# Altium schematic sheet USB.SchDoc: USB
size A3; Author: Eladio Delgado Mingorance; CompanyName: bq - Mundo Reader; Organization: bq - Mundo Reader; Revision: 1.4; SheetNumber: 5; SheetTotal: 10
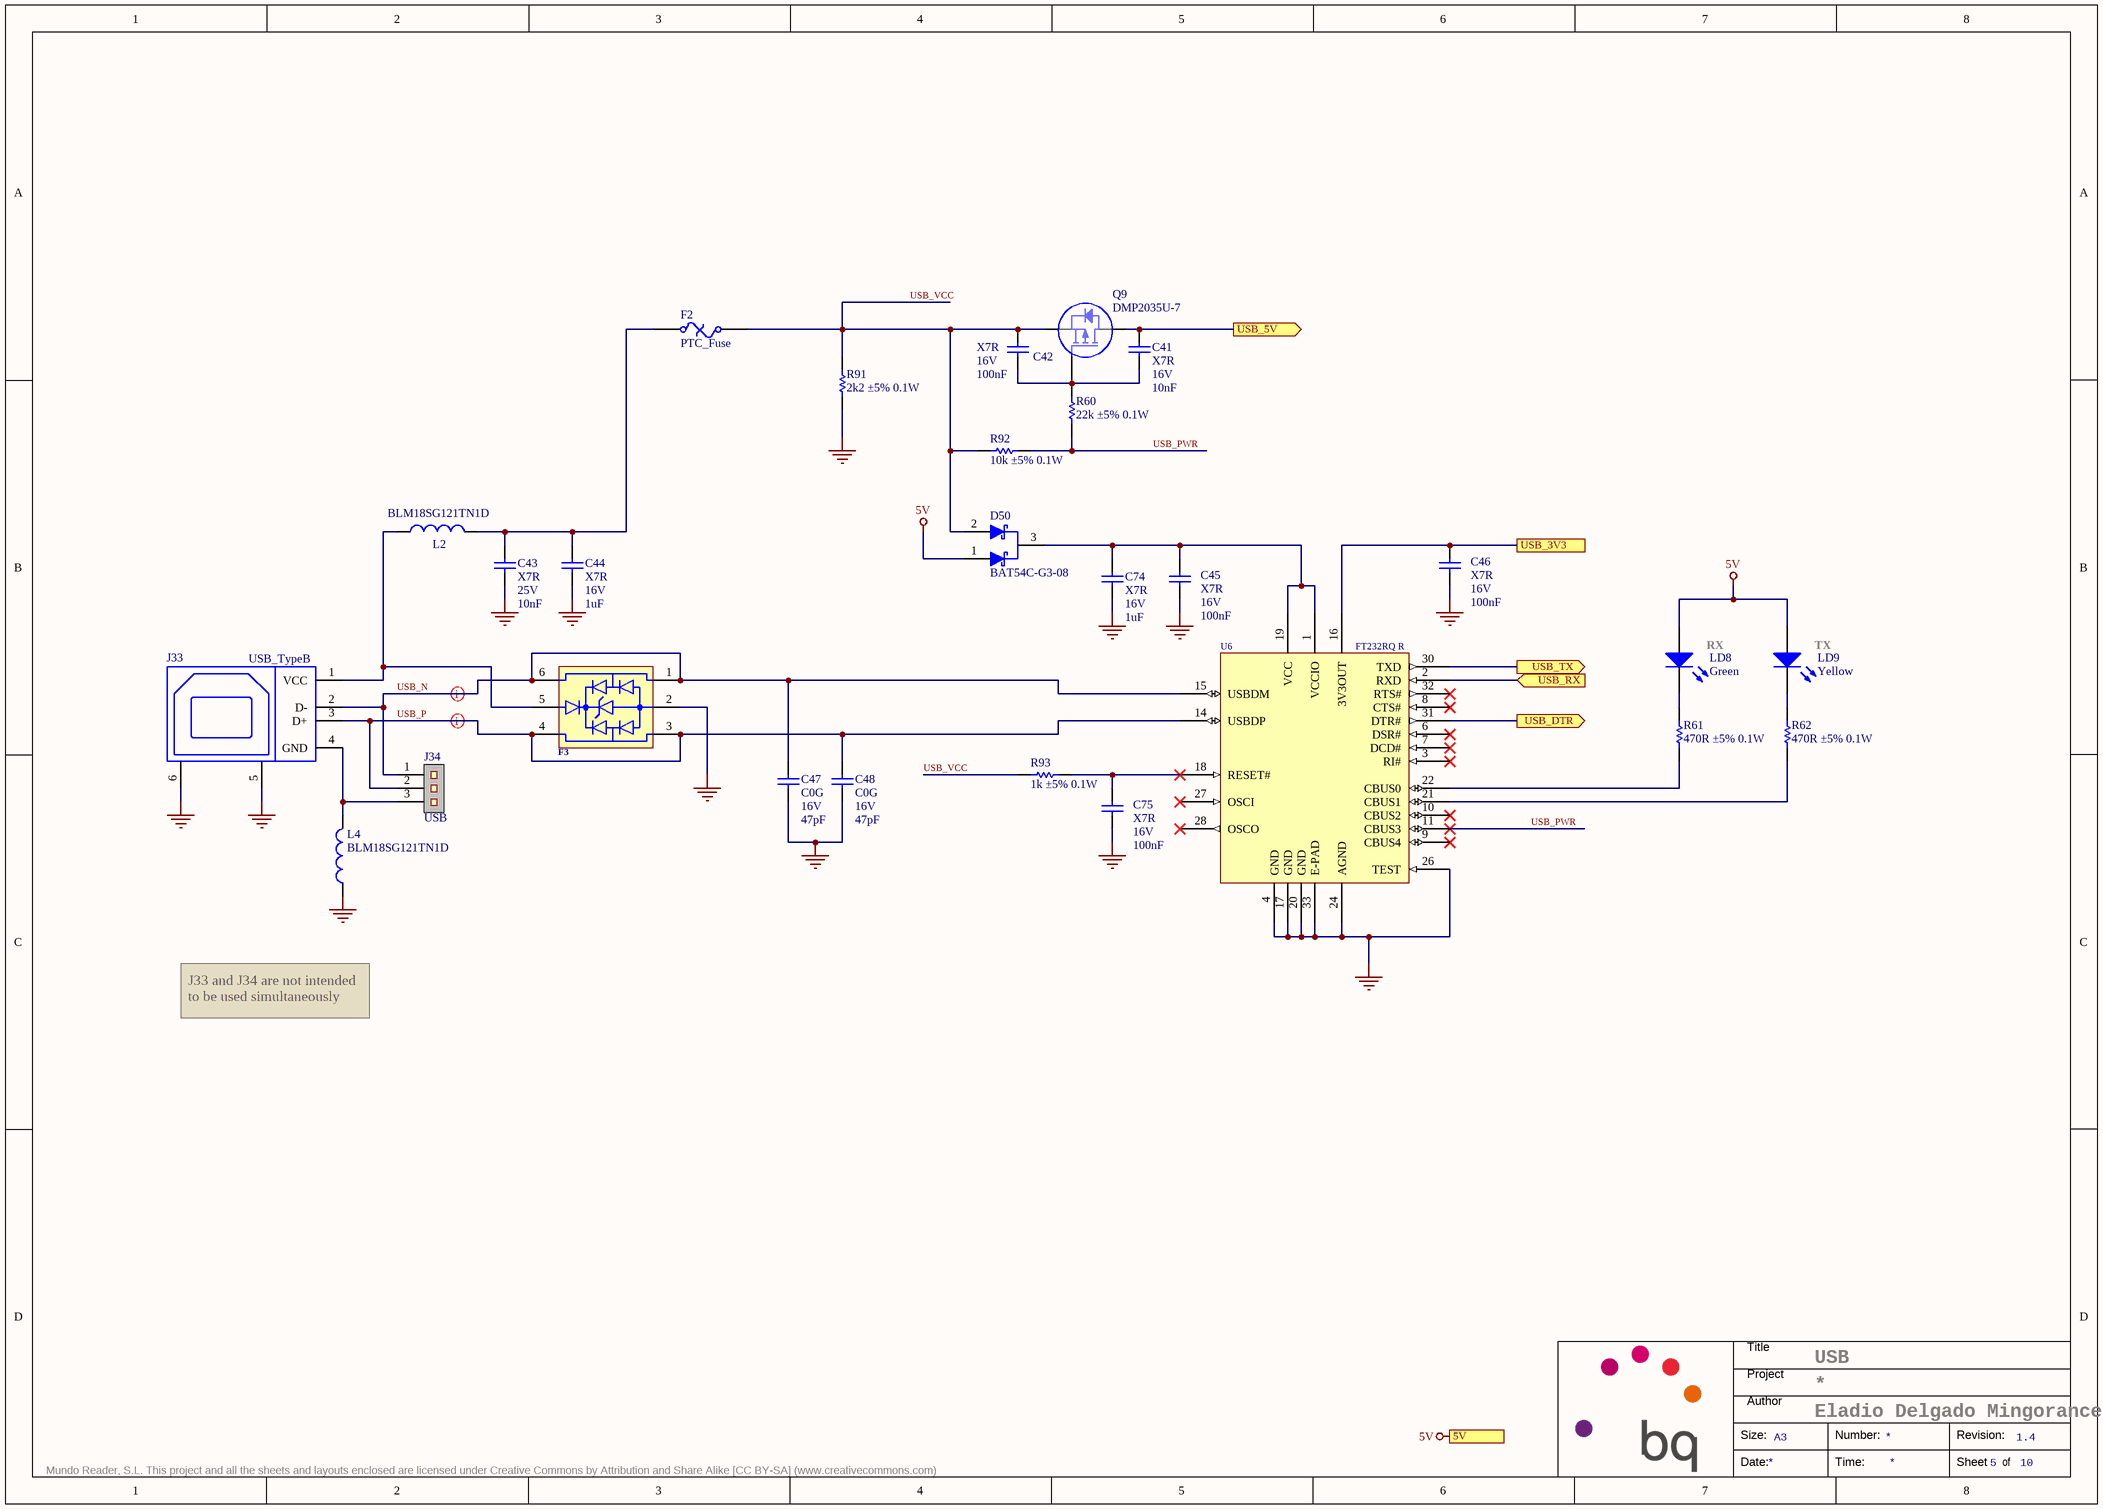
[diagram p0: USB.SchDoc]

## Parts
C41  Dielectric: X7R  Voltage: 16V  Capacitance: 10nF  [C0603]  (hidden comment: Capacitor)
C42  Dielectric: X7R  Voltage: 16V  Capacitance: 100nF  [C0603]  (hidden comment: Capacitor)
C43  Dielectric: X7R  Voltage: 25V  Capacitance: 10nF  [C0603]  (hidden comment: Capacitor)
C44  Dielectric: X7R  Voltage: 16V  Capacitance: 1uF  [C0603]  (hidden comment: Capacitor)
C45  Dielectric: X7R  Voltage: 16V  Capacitance: 100nF  [C0603]  (hidden comment: Capacitor)
C46  Dielectric: X7R  Voltage: 16V  Capacitance: 100nF  [C0603]  (hidden comment: Capacitor)
C47  Dielectric: C0G  Voltage: 16V  Capacitance: 47pF  [C0603]  (hidden comment: Capacitor)
C48  Dielectric: C0G  Voltage: 16V  Capacitance: 47pF  [C0603]  (hidden comment: Capacitor)
C74  Dielectric: X7R  Voltage: 16V  Capacitance: 1uF  [C0603]  (hidden comment: Capacitor)
C75  Dielectric: X7R  Voltage: 16V  Capacitance: 100nF  [C0603]  (hidden comment: Capacitor)
D50  BAT54C-G3-08  [SOT23-3]
F2  PTC_Fuse  [F1812]
F3  ESDUSB  [SOT563]  (value not drawn)
J33  USB_TypeB  [USB_TypeB]
J34  USB  [1x3 MTE Straight Header 2.54mm]
L2  BLM18SG121TN1D  [L0603]
L4  BLM18SG121TN1D  [L0603]
LD8  Green  [LED0603]
LD9  Yellow  [LED0603]
Q9  DMP2035U-7  [SOT23-3]
R60  value 22k ±5% 0.1W  [R0603]  (hidden comment: Resistor)
R61  value 470R ±5% 0.1W  [R0603]  (hidden comment: Resistor)
R62  value 470R ±5% 0.1W  [R0603]  (hidden comment: Resistor)
R91  value 2k2 ±5% 0.1W  [R0603]  (hidden comment: Resistor)
R92  value 10k ±5% 0.1W  [R0603]  (hidden comment: Resistor)
R93  value 1k ±5% 0.1W  [R0603]  (hidden comment: Resistor)
U6  FT232RQ R  [QFN32]

## Ports
5V, USB_3V3, USB_5V (out), USB_DTR (out), USB_RX (in), USB_TX (out)

## Nets
5V: D50.1(A1) LD8.A LD9.A ; port 5V
GND: C43.1 C44.1 C45.1 C46.1 C47.1 C48.1 C74.1 C75.1 F3.2(GND) J33.5(S) J33.6(S) L4.1 R91.2 U6.4(GND) U6.17(GND) U6.20(GND) U6.24(AGND) U6.26(TEST) U6.33(E-PAD)
USB_3V3: C46.2 U6.16(3V3OUT) ; port USB_3V3
USB_5V: C41.2 Q9.3(D) ; port USB_5V
USB_DTR: U6.31(DTR#) ; port USB_DTR
USB_N: C47.2 F3.1(I/0_1) F3.6(I/O_1) J33.2(D-) J34.1 U6.15(USBDM)
USB_P: C48.2 F3.3(I/O_2) F3.4(I/O_2) J33.3(D+) J34.2 U6.14(USBDP)
USB_PWR: R60.2 R92.1 U6.11(CBUS3)
USB_RX: U6.2(RXD) ; port USB_RX
USB_TX: U6.30(TXD) ; port USB_TX
USB_VCC: C42.2 D50.2(A2) F2.2 Q9.2(S) R91.1 R92.2 R93.1
NetC41_1: C41.1 C42.1 Q9.1(G) R60.1
NetC43_2: C43.2 C44.2 F2.1 L2.2
NetC45_2: C45.2 C74.2 D50.3(K) U6.1(VCCIO) U6.19(VCC)
NetC75_2: C75.2 R93.2 U6.18(RESET#)
NetF3_5: F3.5(VDD) J33.1(VCC) L2.1
NetJ33_4: J33.4(GND) J34.3 L4.2
NetLD8_K: LD8.K R61.2
NetLD9_K: LD9.K R62.2
NetR61_1: R61.1 U6.22(CBUS0)
NetR62_1: R62.1 U6.21(CBUS1)

Not connected (* = marked no-connect by the designer): U6 3(RI#)* 5(N.C.) 6(DSR#)* 7(DCD#)* 8(CTS#)* 9(CBUS4)* 10(CBUS2)* 12(N.C.) 13(N.C.) 23(N.C.) 25(N.C.) 27(OSCI)* 28(OSCO)* 29(N.C.) 32(RTS#)*

## Layout directives
differential pair: USB_N, USB_P

## Notes on the sheet
- (near LD8) RX
- (near LD9) TX
- J33 and J34 are not intended to be used simultaneously
- Title
- Project
- Size:
- Author
- A3
- Number:
- Revision:
- Mundo Reader, S.L. This project and all the sheets and layouts enclosed are licensed under Creative Commons by Attribution and Share Alike [CC BY-SA] (www.creativecommons.com)
- Date:
- Time:
- Sheet
- of

## Library data of the parts
C41 = C0603_10nF_16V_±10%: Capacitor SMD; Manufacturer: Kemet; Value: 10nF ±10% 16V; Tolerance: ±10%; OrderingCode: C0603C103K4RAC; Temp_ Max: 125; Temp_ Min: -55; Part Number: C0603_10nF_16V_±10%; Price (€): 0,035
C42 C45 C46 C75 = C0603_100nF_16V_±10%: Manufacturer: Kemet; Value: 100nF ±10% 16V; Tolerance: ±10%; OrderingCode: C0603C104K4RAC; Temp_ Max: 125; Temp_ Min: -55; Part Number: C0603_100nF_16V_±10%; Price (€): 0,012
C43 = C0603_10nF_25V_±10%: Manufacturer: Kemet; Value: 10nF ±10% 25V; Tolerance: ±10%; OrderingCode: C0603C103K3RAC; Temp_ Max: 125; Temp_ Min: -55; Part Number: C0603_10nF_25V_±10%; Price (€): 0,035
C44 C74 = C0603_1uF_16V_±10%_X7R: Capacitor SMD; Manufacturer: TDK; Value: 1uF ±10% 16V; Tolerance: ±10%; OrderingCode: C1608X7R1C105K080AC; Temp_ Max: 125; Temp_ Min: -55; OrderingCode 2: C0603C105K4RACTU; Part Number: C0603_1uF_16V_±10%_X7R; Price (€): 0,018; Manufacturer 2: Kemet
C47 C48 = C0603_47pF_16V_±10%: Manufacturer: Kemet; Value: 47pF ±10% 16V; Tolerance: ±10%; OrderingCode: C0603C470K4GAC; Temp_ Max: 125; Temp_ Min: -55; Part Number: C0603_47pF_16V_±10%; Price (€): 0,015
D50 = BAT54C: Dual Schottky Diode Common Cathode; Part Number: BAT54C; Manufacturer: Vishay; Ifor: 200mA; Vrrm: 30V; Ifsm: 600mA; Vf: 0,8V; Temp_ Max: 125; Temp_ Min: -55; Value: 200mA 30V; OrderingCode: BAT54C-G3-08; Price (€): 0,042; Manufacturer 2: Fairchild; OrderingCode 2: BAT54C
F2 = FUSE 0.5A 15V: PTC Resettable Fuse; Manufacturer: Bourns; Voltage: 15V; Current: 0.5A; OrderingCode: MF-MSMF050-2; Temp_ Max: 85; Temp_ Min: -40; Part Number: FUSE 0.5A 15V; Price (€): 0,108; Supplier: Abacus
F3 = USB ESD Single: USB ESD Protection; Manufacturer: Würth; OrderingCode: 82400152; Temp_ Max: 125; Temp_ Min: -40; OrderingCode 2: CDSOT563-0502; Part Number: USB ESD Single; Supplier: Würth; Price (€): 0,1; Manufacturer 2: Bourns
J33 = USB RA Type B: USB Type B; Manufacturer: FCI; OrderingCode: 61729-0010BLF; OrderingCode 2: 67068-9000; Temp_ Max: 85; Temp_ Min: -40; Part Number: USB RA Type B; Supplier: Abacus; Manufacturer 2: Molex; Price (€): 0,428
J34 = CON_MTE_HDR_THT2.54_3: 1x3 MTE Straight Header 2.54mm; Manufacturer: TE Connectivity; OrderingCode: 5-104362-2; Temp_ Max: 105; Temp_ Min: -65; Value: 3; Part Number: CON_MTE_HDR_THT2.54_3; Price (€): 0,438; Supplier: Abacus
L2 = L0603_120R_0,025R_3000mA: Manufacturer: Murata; Resistance_100MHz: 120R; Resistance_DC: 0,025R; Current: 3000mA; Temp_ Max: 125; Temp_ Min: -55; Value: 120R 0,025R 3000mA; Part Number: L0603_120R_0,025R_3000mA; OrderingCode: BLM18SG121TN1D; Price (€): 0,053
L4 = L0603_120R_0,025R_3000mA: Ferrite Bead; Manufacturer: Murata; Resistance_100MHz: 120R; Resistance_DC: 0,025R; Current: 3000mA; Temp_ Max: 125; Temp_ Min: -55; Value: 120R 0,025R 3000mA; Part Number: L0603_120R_0,025R_3000mA; OrderingCode: BLM18SG121TN1D; Price (€): 0,053
LD8 = HSMG-C190: Light Emitting Diode; Manufacturer: Avago Technologies; Temp_ Max: 85; Temp_ Min: -40; OrderingCode 2: LG Q971-KN-1; Part Number: HSMG-C190; OrderingCode: HSMG-C190; Price (€): 0,064; Manufacturer 2: OSRAM Opto; Value: Green
LD9 = HSMY-C190: LED; Manufacturer: Avago Technologies; Temp_ Max: 85; Temp_ Min: -40; OrderingCode 2: LY Q971-H1L2-36; Part Number: HSMY-C190; OrderingCode: HSMY-C190; Price (€): 0,064; Manufacturer 2: OSRAM Opto; Value: Yellow
Q9 = DMP2035U: Mosfet Channel P Enhancement Mode; Manufacturer: Diodes Incorporated; Vds: 20V; Vgss: 8V; Id: 3,6A; Temp_ Max: 150; Temp_ Min: -55; Part Number: DMP2035U; OrderingCode: DMP2035U-7; Price (€): 0,08; Supplier: Silica
R60 = R0603_22k_0.1W_±5%: Resistor, SMD; Manufacturer: Vishay; Tolerance: ±5%; OrderingCode: CRCW060322K0JN; Power: 0.1W; Resistance: 22k; Temp_ Max: 155; Temp_ Min: -55; PackageDescription: SMD; Part Number: R0603_22k_0.1W_±5%; Price (€): 0,003
R61 R62 = R0603_470R_0.1W_±5%: Resistor, SMD; Manufacturer: Vishay; Tolerance: ±5%; OrderingCode: CRCW0603470RJN; Power: 0.1W; Resistance: 470R; Temp_ Max: 155; Temp_ Min: -55; PackageDescription: SMD; Part Number: R0603_470R_0.1W_±5%; Price (€): 0,003
R91 = R0603_2k2_0.1W_±5%: Resistor, SMD; Manufacturer: Vishay; Tolerance: ±5%; OrderingCode: CRCW06032K20JN; Power: 0.1W; Resistance: 2k2; Temp_ Max: 155; Temp_ Min: -55; PackageDescription: SMD; Part Number: R0603_2k2_0.1W_±5%; Price (€): 0,003
R92 = R0603_10k_0.1W_±5%: Resistor, SMD; Manufacturer: Vishay; Tolerance: ±5%; OrderingCode: CRCW060310K0JN; Power: 0.1W; Resistance: 10k; Temp_ Max: 155; Temp_ Min: -55; PackageDescription: SMD; Part Number: R0603_10k_0.1W_±5%; Price (€): 0,003
R93 = R0603_1k_0.1W_±5%: Resistor, SMD; Manufacturer: Vishay; Tolerance: ±5%; OrderingCode: CRCW06031K00JN; Power: 0.1W; Resistance: 1k; Temp_ Max: 155; Temp_ Min: -55; PackageDescription: SMD; Part Number: R0603_1k_0.1W_±5%; Price (€): 0,003
U6 = FT232RQ: IC USB TO SERIAL UART 32-QFN; Manufacturer: FTDI; Temp_ Max: 85; Temp_ Min: -40; Part Number: FT232RQ; OrderingCode: FT232RQ R; Price (€): 1,6